# Altium schematic sheet Overview.SchDoc
size A3; SheetNumber: 1; SheetTotal: 10
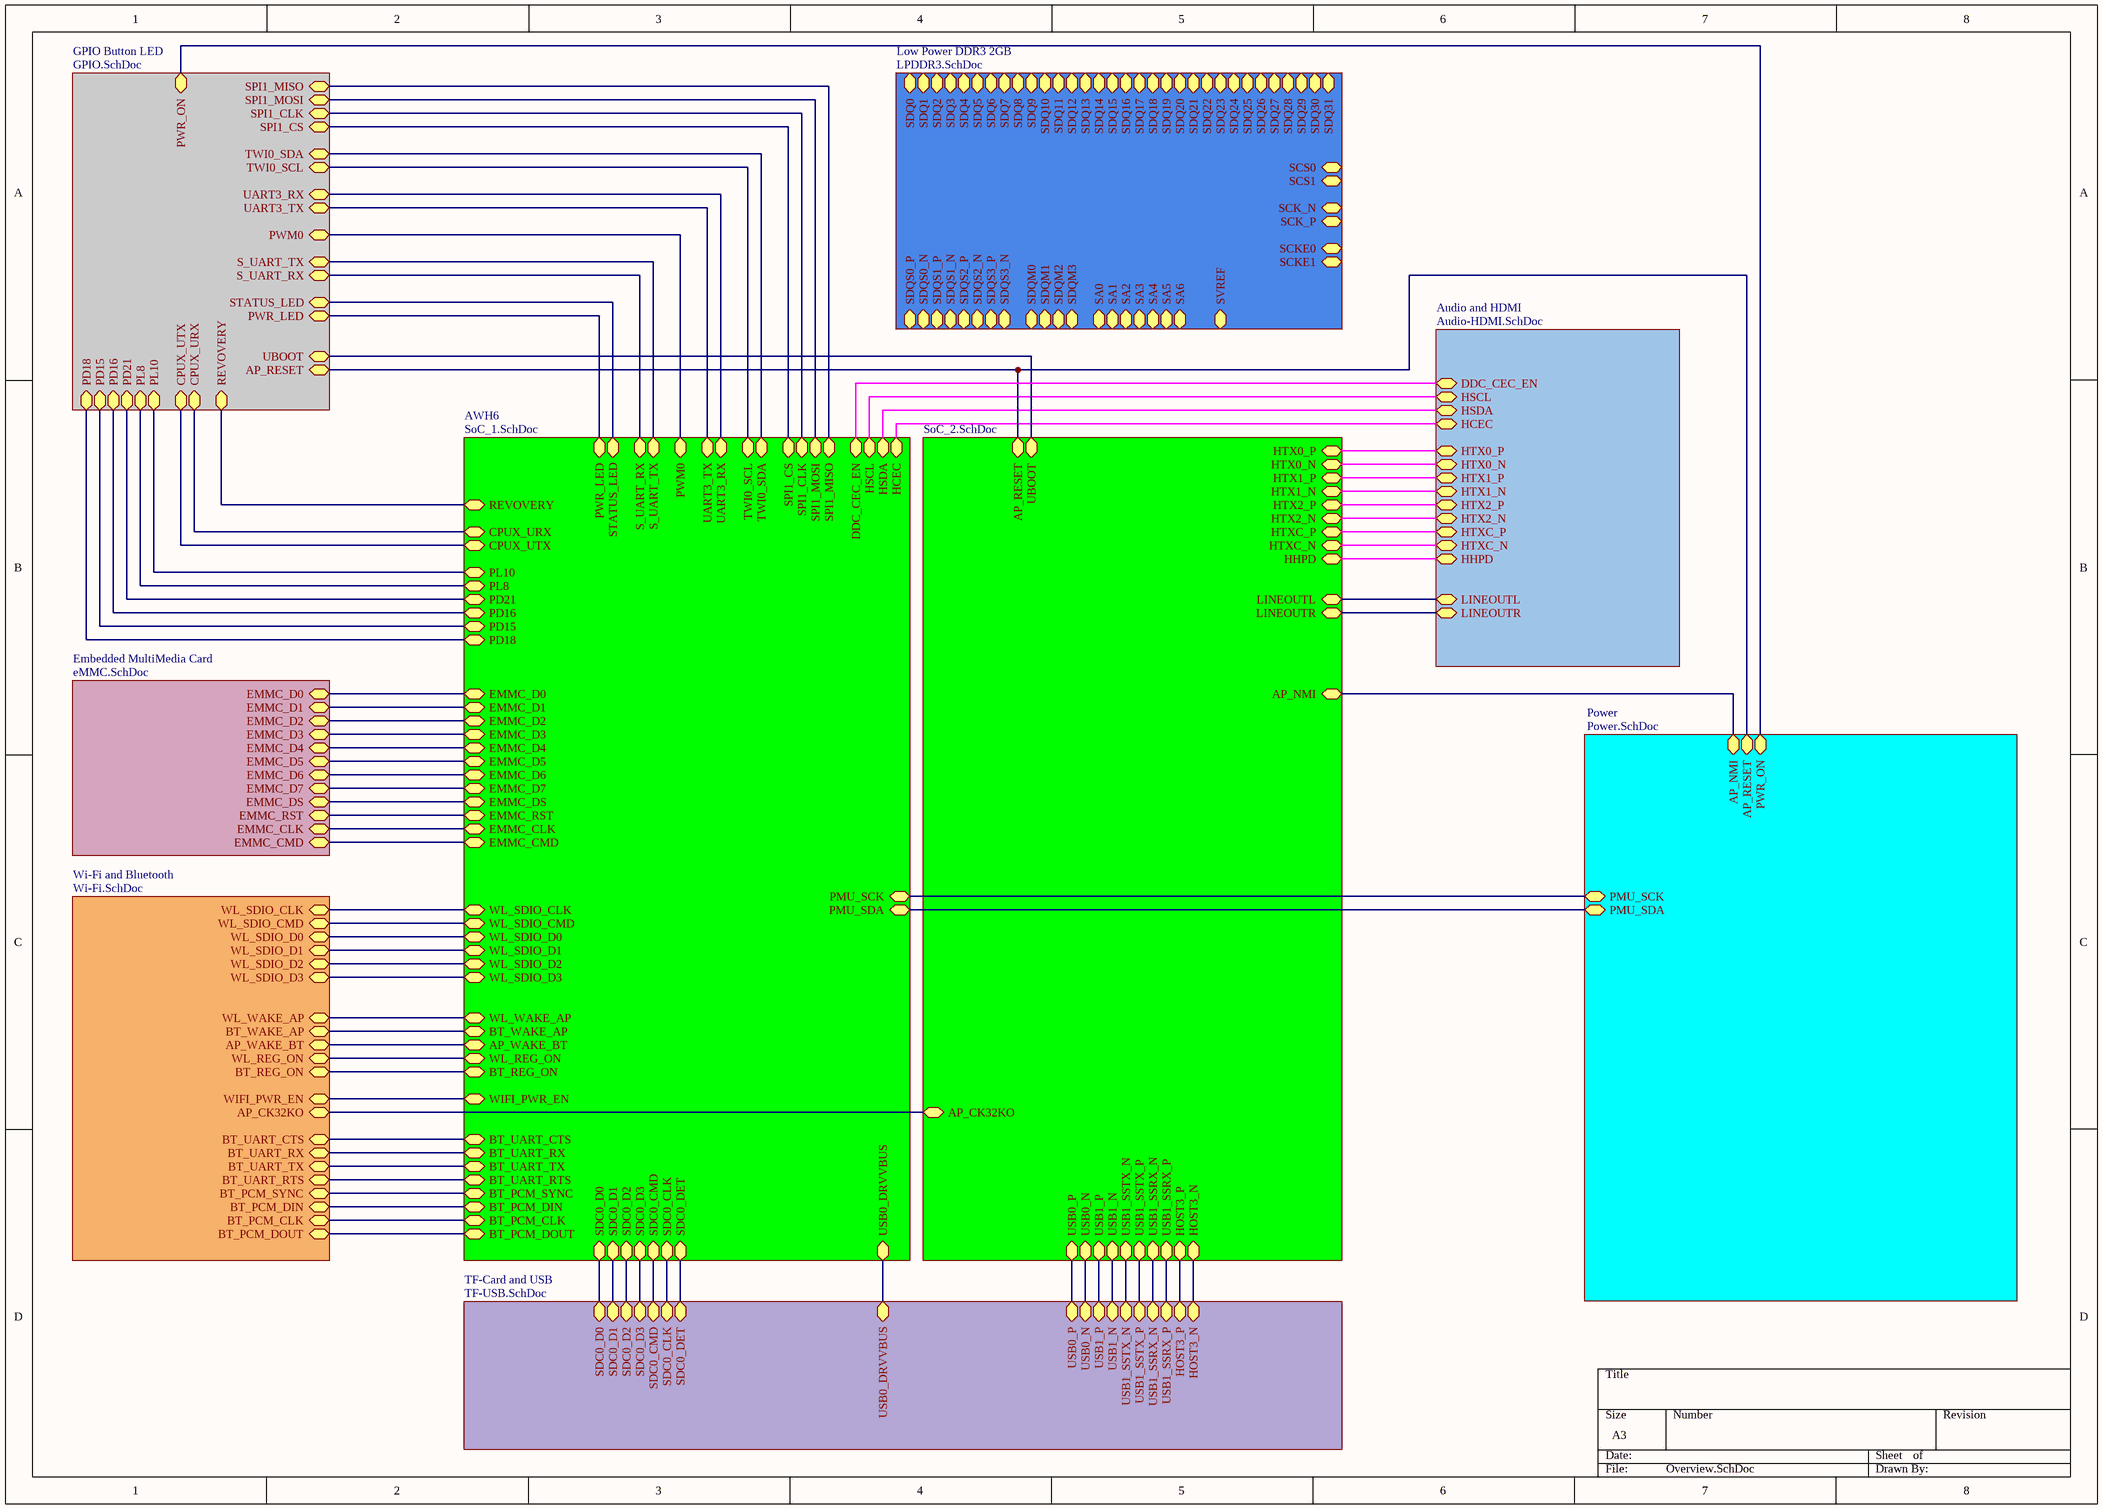
[diagram p0: Overview.SchDoc]

## Sub-sheets
Audio and HDMI = Audio-HDMI.SchDoc: DDC_CEC_EN (bidir), HSCL (bidir), HSDA (bidir), HCEC (bidir), LINEOUTL (bidir), LINEOUTR (bidir), HTX0_P (bidir), HTX0_N (bidir), HTX1_P (bidir), HTX1_N (bidir), HTX2_P (bidir), HTX2_N (bidir), HTXC_P (bidir), HTXC_N (bidir), HHPD (bidir)
AWH6 = SoC_1.SchDoc: DDC_CEC_EN (bidir), HSCL (bidir), HSDA (bidir), HCEC (bidir), WL_SDIO_CLK (bidir), WL_SDIO_CMD (bidir), WL_SDIO_D0 (bidir), WL_SDIO_D1 (bidir), WL_SDIO_D2 (bidir), WL_SDIO_D3 (bidir), WL_WAKE_AP (bidir), BT_WAKE_AP (bidir), AP_WAKE_BT (bidir), WL_REG_ON (bidir), BT_REG_ON (bidir), EMMC_D0 (bidir), EMMC_D1 (bidir), EMMC_D2 (bidir), EMMC_D3 (bidir), EMMC_D4 (bidir), EMMC_D5 (bidir), EMMC_D6 (bidir), EMMC_D7 (bidir), EMMC_DS (bidir), SDC0_D0 (bidir), SDC0_D1 (bidir), SDC0_D2 (bidir), SDC0_D3 (bidir), SDC0_CMD (bidir), SDC0_CLK (bidir), SDC0_DET (bidir), USB0_DRVVBUS (bidir), BT_UART_CTS (bidir), BT_UART_RX (bidir), BT_UART_TX (bidir), BT_UART_RTS (bidir), BT_PCM_SYNC (bidir), BT_PCM_DIN (bidir), BT_PCM_CLK (bidir), BT_PCM_DOUT (bidir), WIFI_PWR_EN (bidir), SPI1_MISO (bidir), SPI1_MOSI (bidir), SPI1_CLK (bidir), SPI1_CS (bidir), TWI0_SDA (bidir), TWI0_SCL (bidir), UART3_RX (bidir), UART3_TX (bidir), PWM0 (bidir), S_UART_TX (bidir), S_UART_RX (bidir), PD18 (bidir), PD15 (bidir), PD16 (bidir), PD21 (bidir), PL8 (bidir), PL10 (bidir), STATUS_LED (bidir), PWR_LED (bidir), CPUX_UTX (bidir), CPUX_URX (bidir), EMMC_RST (bidir), EMMC_CLK (bidir), EMMC_CMD (bidir), REVOVERY (bidir), PMU_SCK (bidir), PMU_SDA (bidir)
Embedded MultiMedia Card = eMMC.SchDoc: EMMC_D0 (bidir), EMMC_D1 (bidir), EMMC_D2 (bidir), EMMC_D3 (bidir), EMMC_D4 (bidir), EMMC_D5 (bidir), EMMC_D6 (bidir), EMMC_D7 (bidir), EMMC_DS (bidir), EMMC_CLK (bidir), EMMC_CMD (bidir), EMMC_RST (bidir)
GPIO Button LED = GPIO.SchDoc: PWM0 (bidir), TWI0_SCL (bidir), TWI0_SDA (bidir), UART3_RX (bidir), UART3_TX (bidir), SPI1_CS (bidir), SPI1_CLK (bidir), SPI1_MOSI (bidir), SPI1_MISO (bidir), S_UART_TX (bidir), S_UART_RX (bidir), PD18 (bidir), PD15 (bidir), PD16 (bidir), PD21 (bidir), PL8 (bidir), PL10 (bidir), STATUS_LED (bidir), PWR_LED (bidir), CPUX_UTX (bidir), CPUX_URX (bidir), REVOVERY (bidir), AP_RESET (bidir), UBOOT (bidir), PWR_ON (bidir)
Low Power DDR3 2GB = LPDDR3.SchDoc: SDQ0 (bidir), SDQ1 (bidir), SDQ2 (bidir), SDQ3 (bidir), SDQ4 (bidir), SDQ5 (bidir), SDQ6 (bidir), SDQ7 (bidir), SDQ8 (bidir), SDQ9 (bidir), SDQ10 (bidir), SDQ11 (bidir), SDQ12 (bidir), SDQ13 (bidir), SDQ14 (bidir), SDQ15 (bidir), SDQ16 (bidir), SDQ17 (bidir), SDQ18 (bidir), SDQ19 (bidir), SDQ20 (bidir), SDQ21 (bidir), SDQ22 (bidir), SDQ23 (bidir), SDQ24 (bidir), SDQ25 (bidir), SDQ26 (bidir), SDQ27 (bidir), SDQ28 (bidir), SDQ29 (bidir), SDQ30 (bidir), SDQ31 (bidir), SDQS0_P (bidir), SDQS0_N (bidir), SDQS1_P (bidir), SDQS1_N (bidir), SDQS2_P (bidir), SDQS2_N (bidir), SDQS3_P (bidir), SDQS3_N (bidir), SDQM0 (bidir), SDQM1 (bidir), SDQM2 (bidir), SDQM3 (bidir), SA0 (bidir), SA1 (bidir), SA2 (bidir), SA3 (bidir), SA4 (bidir), SA5 (bidir), SA6 (bidir), SCS0 (bidir), SCS1 (bidir), SCK_N (bidir), SCK_P (bidir), SCKE0 (bidir), SCKE1 (bidir), SVREF (bidir)
Power = Power.SchDoc: PWR_ON (bidir), AP_RESET (bidir), AP_NMI (bidir), PMU_SCK (bidir), PMU_SDA (bidir)
TF-Card and USB = TF-USB.SchDoc: SDC0_D0 (bidir), SDC0_D1 (bidir), SDC0_D2 (bidir), SDC0_D3 (bidir), SDC0_CMD (bidir), SDC0_CLK (bidir), SDC0_DET (bidir), USB1_P (bidir), USB0_N (bidir), USB0_P (bidir), USB1_N (bidir), USB1_SSTX_N (bidir), USB1_SSTX_P (bidir), USB1_SSRX_N (bidir), USB1_SSRX_P (bidir), HOST3_P (bidir), HOST3_N (bidir), USB0_DRVVBUS (bidir)
U_MPU_2 = SoC_2.SchDoc: LINEOUTL (bidir), LINEOUTR (bidir), HTX0_P (bidir), HTX0_N (bidir), HTX1_P (bidir), HTX1_N (bidir), HTX2_P (bidir), HTX2_N (bidir), HTXC_P (bidir), HTXC_N (bidir), HHPD (bidir), HOST3_N (bidir), HOST3_P (bidir), USB1_SSRX_P (bidir), USB1_SSRX_N (bidir), USB1_SSTX_P (bidir), USB1_SSTX_N (bidir), USB1_N (bidir), USB1_P (bidir), USB0_N (bidir), USB0_P (bidir), AP_RESET (bidir), UBOOT (bidir), AP_CK32KO (bidir), AP_NMI (bidir)
Wi-Fi and Bluetooth = Wi-Fi.SchDoc: WL_SDIO_CLK (bidir), WL_SDIO_CMD (bidir), WL_SDIO_D0 (bidir), WL_SDIO_D1 (bidir), WL_SDIO_D2 (bidir), WL_SDIO_D3 (bidir), BT_REG_ON (bidir), WL_REG_ON (bidir), AP_WAKE_BT (bidir), BT_WAKE_AP (bidir), WL_WAKE_AP (bidir), BT_UART_CTS (bidir), BT_UART_RX (bidir), BT_UART_TX (bidir), BT_UART_RTS (bidir), BT_PCM_SYNC (bidir), BT_PCM_DIN (bidir), BT_PCM_CLK (bidir), BT_PCM_DOUT (bidir), WIFI_PWR_EN (bidir), AP_CK32KO (bidir)

## Nets
(unnamed): sheet AWH6/DDC_CEC_EN, sheet Audio and HDMI/DDC_CEC_EN
(unnamed): sheet AWH6/HSCL, sheet Audio and HDMI/HSCL
(unnamed): sheet AWH6/HSDA, sheet Audio and HDMI/HSDA
(unnamed): sheet AWH6/HCEC, sheet Audio and HDMI/HCEC
(unnamed): sheet AWH6/WL_SDIO_CLK, sheet Wi-Fi and Bluetooth/WL_SDIO_CLK
(unnamed): sheet AWH6/WL_SDIO_CMD, sheet Wi-Fi and Bluetooth/WL_SDIO_CMD
(unnamed): sheet AWH6/WL_SDIO_D0, sheet Wi-Fi and Bluetooth/WL_SDIO_D0
(unnamed): sheet AWH6/WL_SDIO_D1, sheet Wi-Fi and Bluetooth/WL_SDIO_D1
(unnamed): sheet AWH6/WL_SDIO_D2, sheet Wi-Fi and Bluetooth/WL_SDIO_D2
(unnamed): sheet AWH6/WL_SDIO_D3, sheet Wi-Fi and Bluetooth/WL_SDIO_D3
(unnamed): sheet AWH6/WL_WAKE_AP, sheet Wi-Fi and Bluetooth/WL_WAKE_AP
(unnamed): sheet AWH6/BT_WAKE_AP, sheet Wi-Fi and Bluetooth/BT_WAKE_AP
(unnamed): sheet AWH6/AP_WAKE_BT, sheet Wi-Fi and Bluetooth/AP_WAKE_BT
(unnamed): sheet AWH6/WL_REG_ON, sheet Wi-Fi and Bluetooth/WL_REG_ON
(unnamed): sheet AWH6/BT_REG_ON, sheet Wi-Fi and Bluetooth/BT_REG_ON
(unnamed): sheet AWH6/EMMC_D0, sheet Embedded MultiMedia Card/EMMC_D0
(unnamed): sheet AWH6/EMMC_D1, sheet Embedded MultiMedia Card/EMMC_D1
(unnamed): sheet AWH6/EMMC_D2, sheet Embedded MultiMedia Card/EMMC_D2
(unnamed): sheet AWH6/EMMC_D3, sheet Embedded MultiMedia Card/EMMC_D3
(unnamed): sheet AWH6/EMMC_D4, sheet Embedded MultiMedia Card/EMMC_D4
(unnamed): sheet AWH6/EMMC_D5, sheet Embedded MultiMedia Card/EMMC_D5
(unnamed): sheet AWH6/EMMC_D6, sheet Embedded MultiMedia Card/EMMC_D6
(unnamed): sheet AWH6/EMMC_D7, sheet Embedded MultiMedia Card/EMMC_D7
(unnamed): sheet AWH6/EMMC_DS, sheet Embedded MultiMedia Card/EMMC_DS
(unnamed): sheet AWH6/SDC0_D0, sheet TF-Card and USB/SDC0_D0
(unnamed): sheet AWH6/SDC0_D1, sheet TF-Card and USB/SDC0_D1
(unnamed): sheet AWH6/SDC0_D2, sheet TF-Card and USB/SDC0_D2
(unnamed): sheet AWH6/SDC0_D3, sheet TF-Card and USB/SDC0_D3
(unnamed): sheet AWH6/SDC0_CMD, sheet TF-Card and USB/SDC0_CMD
(unnamed): sheet AWH6/SDC0_CLK, sheet TF-Card and USB/SDC0_CLK
(unnamed): sheet AWH6/SDC0_DET, sheet TF-Card and USB/SDC0_DET
(unnamed): sheet AWH6/USB0_DRVVBUS, sheet TF-Card and USB/USB0_DRVVBUS
(unnamed): sheet AWH6/BT_UART_CTS, sheet Wi-Fi and Bluetooth/BT_UART_CTS
(unnamed): sheet AWH6/BT_UART_RX, sheet Wi-Fi and Bluetooth/BT_UART_RX
(unnamed): sheet AWH6/BT_UART_TX, sheet Wi-Fi and Bluetooth/BT_UART_TX
(unnamed): sheet AWH6/BT_UART_RTS, sheet Wi-Fi and Bluetooth/BT_UART_RTS
(unnamed): sheet AWH6/BT_PCM_SYNC, sheet Wi-Fi and Bluetooth/BT_PCM_SYNC
(unnamed): sheet AWH6/BT_PCM_DIN, sheet Wi-Fi and Bluetooth/BT_PCM_DIN
(unnamed): sheet AWH6/BT_PCM_CLK, sheet Wi-Fi and Bluetooth/BT_PCM_CLK
(unnamed): sheet AWH6/BT_PCM_DOUT, sheet Wi-Fi and Bluetooth/BT_PCM_DOUT
(unnamed): sheet AWH6/WIFI_PWR_EN, sheet Wi-Fi and Bluetooth/WIFI_PWR_EN
(unnamed): sheet AWH6/SPI1_MISO, sheet GPIO Button LED/SPI1_MISO
(unnamed): sheet AWH6/SPI1_MOSI, sheet GPIO Button LED/SPI1_MOSI
(unnamed): sheet AWH6/SPI1_CLK, sheet GPIO Button LED/SPI1_CLK
(unnamed): sheet AWH6/SPI1_CS, sheet GPIO Button LED/SPI1_CS
(unnamed): sheet AWH6/TWI0_SDA, sheet GPIO Button LED/TWI0_SDA
(unnamed): sheet AWH6/TWI0_SCL, sheet GPIO Button LED/TWI0_SCL
(unnamed): sheet AWH6/UART3_RX, sheet GPIO Button LED/UART3_RX
(unnamed): sheet AWH6/UART3_TX, sheet GPIO Button LED/UART3_TX
(unnamed): sheet AWH6/PWM0, sheet GPIO Button LED/PWM0
(unnamed): sheet AWH6/S_UART_TX, sheet GPIO Button LED/S_UART_TX
(unnamed): sheet AWH6/S_UART_RX, sheet GPIO Button LED/S_UART_RX
(unnamed): sheet AWH6/PD18, sheet GPIO Button LED/PD18
(unnamed): sheet AWH6/PD15, sheet GPIO Button LED/PD15
(unnamed): sheet AWH6/PD16, sheet GPIO Button LED/PD16
(unnamed): sheet AWH6/PD21, sheet GPIO Button LED/PD21
(unnamed): sheet AWH6/PL8, sheet GPIO Button LED/PL8
(unnamed): sheet AWH6/PL10, sheet GPIO Button LED/PL10
(unnamed): sheet AWH6/STATUS_LED, sheet GPIO Button LED/STATUS_LED
(unnamed): sheet AWH6/PWR_LED, sheet GPIO Button LED/PWR_LED
(unnamed): sheet AWH6/CPUX_UTX, sheet GPIO Button LED/CPUX_UTX
(unnamed): sheet AWH6/CPUX_URX, sheet GPIO Button LED/CPUX_URX
(unnamed): sheet AWH6/EMMC_RST, sheet Embedded MultiMedia Card/EMMC_RST
(unnamed): sheet AWH6/EMMC_CLK, sheet Embedded MultiMedia Card/EMMC_CLK
(unnamed): sheet AWH6/EMMC_CMD, sheet Embedded MultiMedia Card/EMMC_CMD
(unnamed): sheet AWH6/REVOVERY, sheet GPIO Button LED/REVOVERY
(unnamed): sheet AWH6/PMU_SCK, sheet Power/PMU_SCK
(unnamed): sheet AWH6/PMU_SDA, sheet Power/PMU_SDA
(unnamed): sheet Power/PWR_ON, sheet GPIO Button LED/PWR_ON
(unnamed): sheet Power/AP_RESET, sheet U_MPU_2/AP_RESET, sheet GPIO Button LED/AP_RESET
(unnamed): sheet Power/AP_NMI, sheet U_MPU_2/AP_NMI
(unnamed): sheet TF-Card and USB/USB1_P, sheet U_MPU_2/USB1_P
(unnamed): sheet TF-Card and USB/USB0_N, sheet U_MPU_2/USB0_N
(unnamed): sheet TF-Card and USB/USB0_P, sheet U_MPU_2/USB0_P
(unnamed): sheet TF-Card and USB/USB1_N, sheet U_MPU_2/USB1_N
(unnamed): sheet TF-Card and USB/USB1_SSTX_N, sheet U_MPU_2/USB1_SSTX_N
(unnamed): sheet TF-Card and USB/USB1_SSTX_P, sheet U_MPU_2/USB1_SSTX_P
(unnamed): sheet TF-Card and USB/USB1_SSRX_N, sheet U_MPU_2/USB1_SSRX_N
(unnamed): sheet TF-Card and USB/USB1_SSRX_P, sheet U_MPU_2/USB1_SSRX_P
(unnamed): sheet TF-Card and USB/HOST3_P, sheet U_MPU_2/HOST3_P
(unnamed): sheet TF-Card and USB/HOST3_N, sheet U_MPU_2/HOST3_N
(unnamed): sheet Audio and HDMI/LINEOUTL, sheet U_MPU_2/LINEOUTL
(unnamed): sheet Audio and HDMI/LINEOUTR, sheet U_MPU_2/LINEOUTR
(unnamed): sheet Audio and HDMI/HTX0_P, sheet U_MPU_2/HTX0_P
(unnamed): sheet Audio and HDMI/HTX0_N, sheet U_MPU_2/HTX0_N
(unnamed): sheet Audio and HDMI/HTX1_P, sheet U_MPU_2/HTX1_P
(unnamed): sheet Audio and HDMI/HTX1_N, sheet U_MPU_2/HTX1_N
(unnamed): sheet Audio and HDMI/HTX2_P, sheet U_MPU_2/HTX2_P
(unnamed): sheet Audio and HDMI/HTX2_N, sheet U_MPU_2/HTX2_N
(unnamed): sheet Audio and HDMI/HTXC_P, sheet U_MPU_2/HTXC_P
(unnamed): sheet Audio and HDMI/HTXC_N, sheet U_MPU_2/HTXC_N
(unnamed): sheet Audio and HDMI/HHPD, sheet U_MPU_2/HHPD
(unnamed): sheet Wi-Fi and Bluetooth/AP_CK32KO, sheet U_MPU_2/AP_CK32KO
(unnamed): sheet U_MPU_2/UBOOT, sheet GPIO Button LED/UBOOT